# Altium schematic sheet StepperDriver.SchDoc
size A
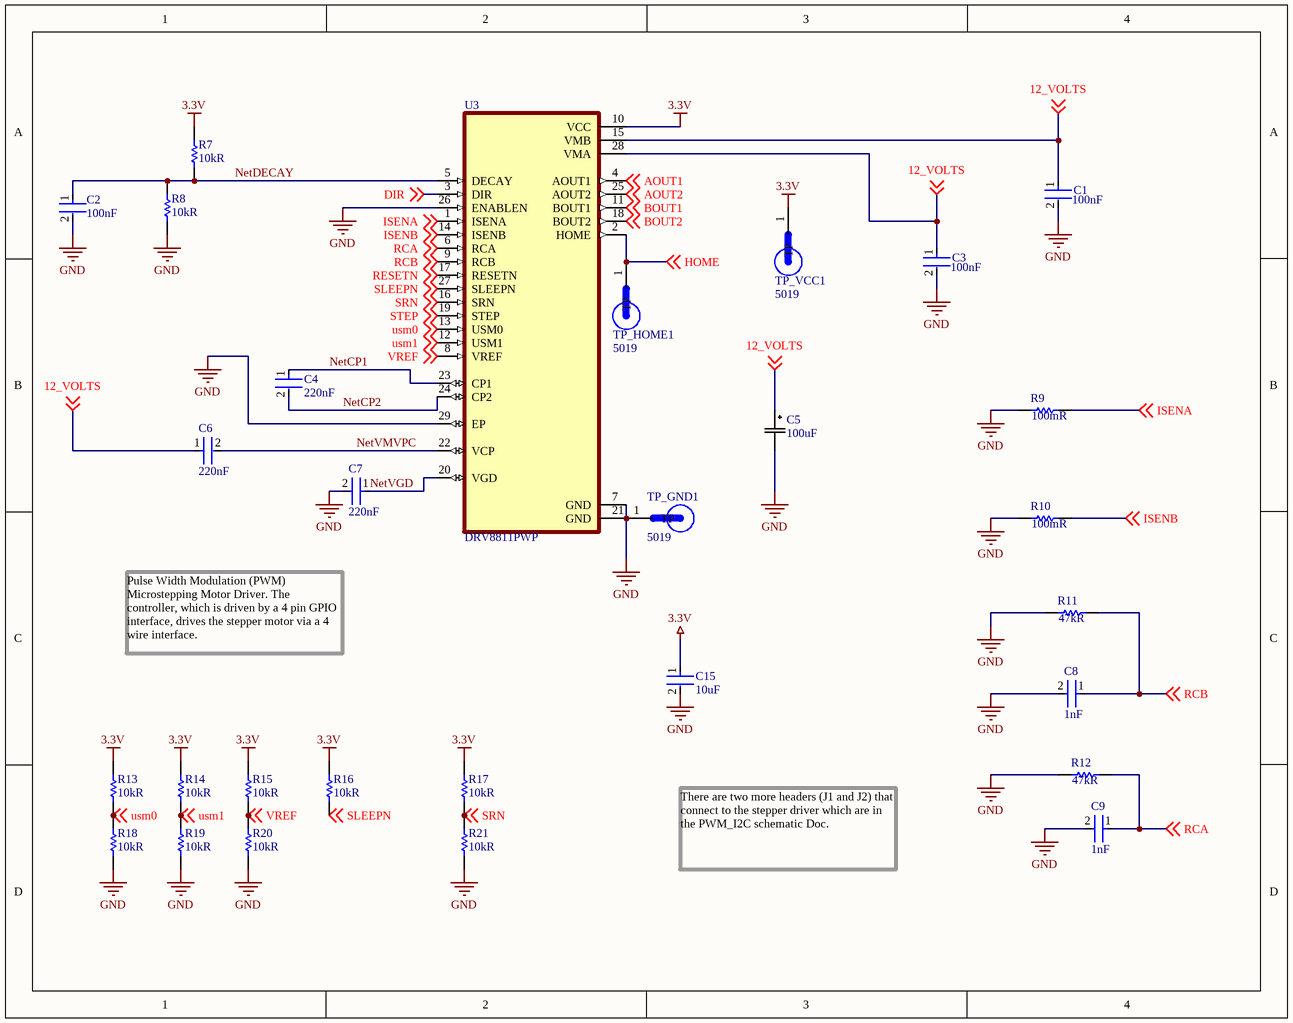
[diagram p0: StepperDriver.SchDoc]

## Parts
C1  Capacitance: 100nF  [FP-CL21-IPC_C]  (hidden comment: CL21B104KACNNNC)
C2  Capacitance: 100nF  [FP-CL21-IPC_C]  (hidden comment: CL21B104KACNNNC)
C3  Capacitance: 100nF  [FP-CL21-IPC_C]  (hidden comment: CL21B104KACNNNC)
C4  Capacitance: 220nF  [FP-0805-L_2_0_0_1-W_1_25-IPC_A]  (hidden comment: UMK212B7224KG-T)
C5  Capacitance: 100uF  [CAP_PC_8X7_NCH]  (hidden comment: PCV1D101MCL2GS)
C6  Capacitance: 220nF  [FP-0805-L_2_0_0_1-W_1_25-IPC_A]  (hidden comment: UMK212B7224KG-T)
C7  Capacitance: 220nF  [FP-0805-L_2_0_0_1-W_1_25-IPC_A]  (hidden comment: UMK212B7224KG-T)
C8  Capacitance: 1nF  [FP-0805-L_2_01_0_2-W_1_25-IPC_C]  (hidden comment: 08055C102KAT2A)
C9  Capacitance: 1nF  [FP-0805-L_2_01_0_2-W_1_25-IPC_C]  (hidden comment: 08055C102KAT2A)
C15  value 10uF  [FP-C0805C-DG-MFG]  (hidden comment: C0805C106K8PACTU)
R7  Resistance: 10kR  [RESC2013X60X35NL10T20]  (hidden comment: RC0805FR-0710KL)
R8  Resistance: 10kR  [RESC2013X60X35NL10T20]  (hidden comment: RC0805FR-0710KL)
R9  Resistance: 100mR  [RESC2013X65X35ML10T20]  (hidden comment: PT0805FR-7W0R1L)
R10  Resistance: 100mR  [RESC2013X65X35ML10T20]  (hidden comment: PT0805FR-7W0R1L)
R11  Resistance: 47kR  [RESC2013X70X40ML20T20]  (hidden comment: ERJ-6GEYJ473V)
R12  Resistance: 47kR  [RESC2013X70X40ML20T20]  (hidden comment: ERJ-6GEYJ473V)
R13  Resistance: 10kR  [RESC2013X60X35NL10T20]  (hidden comment: RC0805FR-0710KL)
R14  Resistance: 10kR  [RESC2013X60X35NL10T20]  (hidden comment: RC0805FR-0710KL)
R15  Resistance: 10kR  [RESC2013X60X35NL10T20]  (hidden comment: RC0805FR-0710KL)
R16  Resistance: 10kR  [RESC2013X60X35NL10T20]  (hidden comment: RC0805FR-0710KL)
R17  Resistance: 10kR  [RESC2013X60X35NL10T20]  (hidden comment: RC0805FR-0710KL)
R18  Resistance: 10kR  [RESC2013X60X35NL10T20]  (hidden comment: RC0805FR-0710KL)
R19  Resistance: 10kR  [RESC2013X60X35NL10T20]  (hidden comment: RC0805FR-0710KL)
R20  Resistance: 10kR  [RESC2013X60X35NL10T20]  (hidden comment: RC0805FR-0710KL)
R21  Resistance: 10kR  [RESC2013X60X35NL10T20]  (hidden comment: RC0805FR-0710KL)
TP_GND1  5019  [TP380X203]
TP_HOME1  5019  [TP380X203]
TP_VCC1  5019  [TP380X203]
U3  DRV8811PWP  [IC_TPS61196PWPRQ1]

## Nets
3.3V: C15.1 R7.2 R13.2 R14.2 R15.2 R16.2 R17.2 TP_VCC1.1(TP) U3.10(VCC)
GND: C1.2 C2.2 C3.2 C5.2 C7.2 C8.2 C9.2 C15.2 R8.1 R9.1 R10.1 R11.1 R12.1 R18.1 R19.1 R20.1 R21.1 TP_GND1.1(TP) U3.7(GND) U3.21(GND) U3.26(ENABLEN) U3.29(EP)
12_VOLTS: C1.1 C3.1 C5.1 C6.1 U3.15(VMB) U3.28(VMA) ; off-sheet 12_VOLTS
AOUT1: U3.4(AOUT1) ; off-sheet AOUT1
AOUT2: U3.25(AOUT2) ; off-sheet AOUT2
BOUT1: U3.11(BOUT1) ; off-sheet BOUT1
BOUT2: U3.18(BOUT2) ; off-sheet BOUT2
DIR: U3.3(DIR) ; off-sheet DIR
HOME: TP_HOME1.1(TP) U3.2(HOME) ; off-sheet HOME
ISENA: R9.2 U3.1(ISENA) ; off-sheet ISENA
ISENB: R10.2 U3.14(ISENB) ; off-sheet ISENB
NetCP1: C4.1 U3.23(CP1)
NetCP2: C4.2 U3.24(CP2)
NetDECAY: C2.1 R7.1 R8.2 U3.5(DECAY)
NetVGD: C7.1 U3.20(VGD)
NetVMVPC: C6.2 U3.22(VCP)
RCA: C9.1 R12.2 U3.6(RCA) ; off-sheet RCA
RCB: C8.1 R11.2 U3.9(RCB) ; off-sheet RCB
RESETN: U3.17(RESETN) ; off-sheet RESETN
SLEEPN: R16.1 U3.27(SLEEPN) ; off-sheet SLEEPN
SRN: R17.1 R21.2 U3.16(SRN) ; off-sheet SRN
STEP: U3.19(STEP) ; off-sheet STEP
usm0: R13.1 R18.2 U3.13(USM0) ; off-sheet usm0
usm1: R14.1 R19.2 U3.12(USM1) ; off-sheet usm1
VREF: R15.1 R20.2 U3.8(VREF) ; off-sheet VREF

## Notes on the sheet
- Pulse Width Modulation (PWM) Microstepping Motor Driver. The controller, which is driven by a 4 pin GPIO interface, drives the stepper motor via a 4 wire interface.
- There are two more headers (J1 and J2) that connect to the stepper driver which are in the PWM_I2C schematic Doc.

## Library data of the parts
C1-C3 = CMP-13271-002854-1: CL21 Series 0805 100nF 25V ±10% Tolerance X7R Multilayer Ceramic Chip Capacitor; Manufacturer: Samsung; Thickness: 0.037inch; Dielectric: X7R; Packaging: Tape and Reel; Height: 0.85mm; Case/Package: 0805; Mount: Surface Mount; Case Code (Imperial): 0805; Case Code (Metric): 2012; Length: 2mm; Voltage Rating: 25V; Voltage: 25V; Contact Plating: Tin; Tolerance: 10%; Max Operating Temperature: 125°C; Width: 0.049inch; Min Operating Temperature: -55°C; Radiation Hardening: No; Package Quantity: 1; Depth: 1.25mm; Supplier 1: Digi-Key; Supplier Part Number 1: 1276-1099-1-ND; Manufacturer Part Number: CL21B104KACNNNC; RoHS: Yes; Category: Ceramic Capacitors; Stock 1: 1473590; Pricing 1: 1=0.10000, 10=0.03700, 50=0.02020, 100=0.01650, 500=0.01178, 1000=0.00925 (USD); Series: CL; Construction: Flat; RoHS Compliant: Yes; ComponentLink1URL: https://datasheet.ciiva.com/25801/cl21b104kacnnnc-25801824.pdf?src-supplier=Digi-Key; ComponentLink1Description: https://datasheet.ciiva.com/25801/cl21b104kacnnnc-25801824.pdf?src-supplier=Digi-Key; ComponentLink2URL: https://datasheet.ciiva.com/15216/getdatasheetpartid-355204-15216236.pdf?src-supplier=Verical; ComponentLink2Description: https://datasheet.ciiva.com/15216/getdatasheetpartid-355204-15216236.pdf?src-supplier=Verical
C4 C6 C7 = CMP-14477-005057-2: Multilayer Ceramic Capacitor 0.22 uF 50V X7R 10% SMD 0805 T/R; Manufacturer: Taiyo Yuden; Voltage Rating: 50V; Width: 0.049inch; Series: M; Tolerance: 10%; Dielectric: X7R; Min Operating Temperature: -55°C; Mount: Surface Mount; Length: 2mm; RoHS Compliant: Yes; Radiation Hardening: No; Contact Plating: Nickel; Depth: 1.25mm; Case Code (Imperial): 0805; Height: 1.25mm; Construction: Flat; Case/Package: 0805; Thickness: 0.053inch; Voltage: 50V; Case Code (Metric): 2012; Halogen Free: Halogen Free; Termination: SMD/SMT; Package Quantity: 1; Max Operating Temperature: 125°C; Packaging: Tape and Reel; Voltage Rating (DC): 50V; Supplier 1: Digi-Key; Supplier Part Number 1: 587-1287-1-ND; Manufacturer Part Number: UMK212B7224KG-T; RoHS: Yes; Category: Ceramic Capacitors; Stock 1: 1309484; Pricing 1: 1=0.13000, 10=0.09300, 50=0.05300, 100=0.04390, 500=0.03080, 1000=0.02550 (USD); REACH SVHC: Unknown; ComponentLink1URL: https://datasheet.ciiva.com/133/umk212b7224kg-t-ss-133747.pdf?src-supplier=Digi-Key; ComponentLink1Description: https://datasheet.ciiva.com/133/umk212b7224kg-t-ss-133747.pdf?src-supplier=Digi-Key; ComponentLink2URL: https://datasheet.ciiva.com/30106/209umk212b7224kg-t-30106923.pdf?src-supplier=Onlinecomponents.com; ComponentLink2Description: https://datasheet.ciiva.com/30106/209umk212b7224kg-t-30106923.pdf?src-supplier=Onlinecomponents.com; ComponentLink3URL: https://datasheet.ciiva.com/15922/1134umk212b7224kg-t-15922643.pdf?src-supplier=Onlinecomponents.com; ComponentLink3Description: https://datasheet.ciiva.com/15922/1134umk212b7224kg-t-15922643.pdf?src-supplier=Onlinecomponents.com; ComponentLink4URL: https://datasheet.ciiva.com/15165/getdatasheetpartid-63436-15165368.pdf?src-supplier=Verical; ComponentLink4Description: https://datasheet.ciiva.com/15165/getdatasheetpartid-63436-15165368.pdf?src-supplier=Verical; ComponentLink5URL: https://datasheet.ciiva.com/30164/55umk212b7224kg-t-30164219.pdf?src-supplier=Onlinecomponents.com; ComponentLink5Description: https://datasheet.ciiva.com/30164/55umk212b7224kg-t-30164219.pdf?src-supplier=Onlinecomponents.com; ComponentLink6URL: https://datasheet.ciiva.com/28645/746258-28645309.pdf?src-supplier=Element14; ComponentLink6Description: https://datasheet.ciiva.com/28645/746258-28645309.pdf?src-supplier=Element14
C5 = PCV1D101MCL2GS: Cap Aluminum Polymer 100uF 20VDC 20% (8 X 7mm) SMD 0.042 Ohm 1400mA 3000h 105C Automotive T/R; Mfr_Name: Nichicon; Type: DEV; Voltage Rating (DC): 20V; ESR (Equivalent Series Resistance): 42mR; Ripple Current: 1.4A; Leakage Current: 400uA; Polarity: Polar; Dissipation Factor: 0.12%; Life (Hours): 3000Hour; Copyright: Copyright (C) 2022 Ultra Librarian. All rights reserved.; Manufacturer_Part_Number: PCV1D101MCL2GS; Digi-Key_Part_Number_1: 493-4532-1-ND; Digi-Key_Part_Number_2: 493-4532-2-ND; Digi-Key_Part_Number_3: 493-4532-6-ND; RefDes: RefDes; Supplier 1: Digi-Key; Supplier Part Number 1: 493-4532-1-ND; Manufacturer: Nichicon; Manufacturer Part Number: PCV1D101MCL2GS; RoHS: Yes; Category: Polymer Capacitors; Stock 1: 12604; Pricing 1: 1=2.46000, 10=1.99300, 50=1.73900, 100=1.52170, 500=1.15938 (USD); Mount: Surface Mount,PCB; Case/Package: Radial; Min Operating Temperature: -55°C; Max Operating Temperature: 105°C; Tolerance: 20%; Package Quantity: 1; Voltage Rating: 20V; Packaging: Tape and Reel; Termination: SMD/SMT; Voltage: 20V; Series: CV; Diameter: 8mm; Length: 7mm; Height: 7mm; Height - Seated (Max): 0.276inch; Lead Pitch: 3.2mm; RoHS Compliant: Yes; ComponentLink1URL: https://datasheet.ciiva.com/115/e-cv-115994.pdf?src-supplier=Digi-Key; ComponentLink1Description: https://datasheet.ciiva.com/115/e-cv-115994.pdf?src-supplier=Digi-Key; ComponentLink2URL: https://datasheet.ciiva.com/115/e-cv-115995.pdf?src-supplier=Digi-Key; ComponentLink2Description: https://datasheet.ciiva.com/115/e-cv-115995.pdf?src-supplier=Digi-Key; ComponentLink3URL: https://datasheet.ciiva.com/115/e-cv-115996.pdf?src-supplier=Digi-Key; ComponentLink3Description: https://datasheet.ciiva.com/115/e-cv-115996.pdf?src-supplier=Digi-Key
C8 C9 = CMP-1036-02979-3: General Purpose Ceramic Capacitor, 0805, 1nF, 10%, X7R, 0.15, 50V; Manufacturer: Kyocera AVX; Dissipation Factor: 2.5%; Insulation Resistance: 100GR; Radiation Hardening: No; Case Code (Imperial): 0805; Packaging: Tape and Reel; Height: 0.94mm; Number of Pins: 2; REACH SVHC: No SVHC; Case Code (Metric): 2012; Voltage: 50V; Max Operating Temperature: 125°C; Tolerance: 10%; Voltage Rating: 50V; Depth: 1.25mm; Voltage Rating (DC): 50V; Thickness: 0.037inch; Termination: SMD/SMT; Package Quantity: 1; RoHS Compliant: Yes; Mount: Surface Mount; Dielectric: X7R; Length: 2.01mm; Contact Plating: Tin; Lead Free: Lead Free; Case/Package: 0805; Width: 1.25mm; Dielectric Material: Ceramic; Min Operating Temperature: -55°C; Supplier 1: Digi-Key; Supplier Part Number 1: 478-1371-1-ND; Manufacturer Part Number: 08055C102KAT2A; RoHS: Yes; Category: Ceramic Capacitors; Stock 1: 651619; Pricing 1: 1=0.10000, 10=0.07300, 50=0.04000, 100=0.03270, 500=0.02334, 1000=0.01833 (USD); ComponentLink1URL: https://datasheet.ciiva.com/19476/2009543-19476290.pdf?src-supplier=Jameco; ComponentLink1Description: https://datasheet.ciiva.com/19476/2009543-19476290.pdf?src-supplier=Jameco; ComponentLink2URL: https://datasheet.ciiva.com/11786/0900766b802d4698-11786944.pdf?src-supplier=RSComponents; ComponentLink2Description: https://datasheet.ciiva.com/11786/0900766b802d4698-11786944.pdf?src-supplier=RSComponents; ComponentLink3URL: https://datasheet.ciiva.com/150/cx7r-150264.pdf?src-supplier=Digi-Key; ComponentLink3Description: https://datasheet.ciiva.com/150/cx7r-150264.pdf?src-supplier=Digi-Key; ComponentLink4URL: https://datasheet.ciiva.com/150/cx7r-150265.pdf?src-supplier=Digi-Key; ComponentLink4Description: https://datasheet.ciiva.com/150/cx7r-150265.pdf?src-supplier=Digi-Key
C15 = CMP-2007-03243-2: CAP CER 10UF 10V X5R 0805; Manufacturer: Kemet; 3DS Part Number: 220-00001; Tolerance: 10%; Temperature Coefficient: 15%; Material: Ceramic; Device Class L2: Capacitors; Device Class L1: Passive Components; ComponentLink2URL: https://content.kemet.com/datasheets/KEM_C1006_X5R_SMD.pdf; Height: 1.4mm; Lead Free: Yes; Manufacturer Part Number: C0805C106K8PACTU; Digikey Description: CAP CER 10UF 10V X5R 0805; Octopart: https://octopart.com/c0805c106k8pactu-kemet-98697; Capacitance: 10uF; Temperature Range Low: -55°C; Temperature: -55°C to +85°C; Automotive: No; Mouser Description: CAP CER 10UF 10V X5R 0805; Ipc Land Pattern Name: CAPC200125X125; Temperature Range High: +85°C; Voltage: 10V; RoHS: TRUE; Device Class L3: Ceramic Capacitors; ComponentLink2Description: Datasheet; Voltage Rating: 10V; Package: C0805C-DG; Temperature Characteristic: X5R; Category: Cap; Supplier 1: Digi-Key; Supplier Part Number 1: 399-C0805C106K8PAC7800CT-ND; Manufacturer 1: KEMET; Manufacturer Part Number 1: C0805C106K8PACTU; Stock 1: 8631846; Pricing 1: 1=0.14000, 10=0.10300, 50=0.05840, 100=0.04830, 500=0.03388, 1000=0.02805 (USD); Mount: Surface Mount; Case/Package: 0805; Number of Pins: 2; Case Code (Imperial): 0805; Case Code (Metric): 2012; Dielectric Material: Ceramic; Contact Plating: Tin,Matte; Min Operating Temperature: -55°C; Max Operating Temperature: 85°C; Packaging: Tape and Reel; Dielectric: X5R; Package Quantity: 1; Voltage Rating (DC): 10V; Series: C; Termination: SMD/SMT; Construction: Flat; Dissipation Factor: 10%; Length: 2mm; Width: 1.2mm; Depth: 1.25mm; Thickness: 0.055inch; Radiation Hardening: No; REACH SVHC: No SVHC; RoHS Compliant: Yes
R7 R8 R13-R21 = CMP-1659-00013-4: Chip Resistor, 10 KOhm, +/- 1%, 0.125 W, -55 to 155 degC, 0805 (2012 Metric), RoHS, Tape and Reel; Manufacturer: Yageo; Voltage Rating: 150 V; Power Rating: 125mW; Temperature Coefficient: 100ppm/°C; Mount: Surface Mount; ComponentLink1Description: Manufacturer URL; ComponentLink2URL: http://www.yageo.com/documents/recent/PYu-RC_Group_51_RoHS_L_04.pdf; Pins: 2; Length: 2 mm; Min Operating Temperature: -55 degC; Height: 0.5 mm; Mounting Technology: Surface Mount; RoHSCompliant: true; REACH SVHC: No SVHC; ComponentLink1URL: http://www.yageo.com/; Max Operating Temperature: 155 degC; PackageReference: 0805; DatasheetVersion: Rev. 4, 02/2016; Package Quantity: 5000; Packaging: Tape and Reel; ComponentLink2Description: Datasheet; PackageDescription: 2-Pin Surface Mounted Device, Body 2 x 1.25 mm; Supplier 1: Digi-Key; Supplier Part Number 1: 311-10.0KCRCT-ND; Manufacturer Part Number: RC0805FR-0710KL; RoHS: Yes; Category: Chip SMD Resistors; Stock 1: 5888109; Pricing 1: 1=0.10000, 10=0.03800, 100=0.01560, 1000=0.00702, 2500=0.00610 (USD); Case/Package: 0805; Case Code (Imperial): 0805; Case Code (Metric): 2012; Size Code: 0805; Tolerance: 1%; Termination: SMD/SMT; Series: RC; Resistance Tolerance: 1%; Max Power Dissipation: 125mW; Resistor Type: Thick Film; Number of Terminations: 2; Features: Moisture Resistant; Construction: Rectangular; Technology: THICK FILM; Width: 0.049inch; Depth: 1.25mm; RoHS Compliant: Yes; Lead Free: Lead Free; Military Standard: Not; ComponentLink3URL: https://datasheet.ciiva.com/11808/0900766b8106beab-11808151.pdf?src-supplier=RSComponents; ComponentLink3Description: https://datasheet.ciiva.com/11808/0900766b8106beab-11808151.pdf?src-supplier=RSComponents; ComponentLink4URL: https://datasheet.ciiva.com/46447/444164-46447563.pdf?src-supplier=Element14; ComponentLink4Description: https://datasheet.ciiva.com/46447/444164-46447563.pdf?src-supplier=Element14; ComponentLink5URL: https://datasheet.ciiva.com/2456/pyu-r-int-thick-7-2456973.pdf?src-supplier=Digi-Key; ComponentLink5Description: https://datasheet.ciiva.com/2456/pyu-r-int-thick-7-2456973.pdf?src-supplier=Digi-Key; ComponentLink6URL: https://datasheet.ciiva.com/2456/pyu-r-int-thick-7-2456974.pdf?src-supplier=Digi-Key; ComponentLink6Description: https://datasheet.ciiva.com/2456/pyu-r-int-thick-7-2456974.pdf?src-supplier=Digi-Key; ComponentLink7URL: https://datasheet.ciiva.com/2456/pyu-r-int-thick-7-2456972.pdf?src-supplier=Digi-Key; ComponentLink7Description: https://datasheet.ciiva.com/2456/pyu-r-int-thick-7-2456972.pdf?src-supplier=Digi-Key; ComponentLink8URL: https://datasheet.ciiva.com/12669/rc0805-12669688.pdf?src-supplier=Mouser; ComponentLink8Description: https://datasheet.ciiva.com/12669/rc0805-12669688.pdf?src-supplier=Mouser; ComponentLink9URL: https://datasheet.ciiva.com/16747/rc0805-16747087.pdf?src-supplier=Future+Electronics; ComponentLink9Description: https://datasheet.ciiva.com/16747/rc0805-16747087.pdf?src-supplier=Future+Electronics
R9 R10 = CMP-2001-04471-1: Manufacturer: Yageo; Tolerance: 1%; Max Power Dissipation: 250mW; Temperature Coefficient: 100ppm/°C; Part Number: PT0805FR-7W0R1L; Supplier 1: Newark; Supplier Part Number 1: 82AH7709; Manufacturer Part Number: PT0805FR-7W0R1L; RoHS: Yes; Category: Chip SMD Resistors; Stock 1: 80; Pricing 1: 1=0.10900, 10=0.10100, 25=0.09500, 50=0.08900, 100=0.08400 (USD); Case/Package: 0805; Case Code (Imperial): 0805; Case Code (Metric): 2012; Min Operating Temperature: -55°C; Max Operating Temperature: 155°C; Features: Moisture Resistant,Automotive AEC-Q200; Series: PT; Packaging: Tape and Reel; Number of Terminations: 2; Lead Free: Lead Free; RoHS Compliant: Yes; ComponentLink1URL: http://www.mouser.com/ds/2/447/yageodocoutput-1101729.pdf?src-supplier=Mouser; ComponentLink1Description: http://www.mouser.com/ds/2/447/yageodocoutput-1101729.pdf?src-supplier=Mouser; ComponentLink2URL: http://www.yageo.com/exep/pages/download/literatures/R-chip_current%20sensor_20140512.pdf?src-supplier=Digi-Key; ComponentLink2Description: http://www.yageo.com/exep/pages/download/literatures/R-chip_current%20sensor_20140512.pdf?src-supplier=Digi-Key
R11 R12 = CMP-2001-00421-1: Manufacturer: Panasonic; Tolerance: 5%; Temperature Coefficient: 200ppm/°C; Power Rating: 125mW; Voltage Rating: 150V; Part Number: ERJ-6GEYJ473V; Supplier 1: Digi-Key; Supplier Part Number 1: P47KACT-ND; Manufacturer Part Number: ERJ-6GEYJ473V; RoHS: Yes; Category: Chip SMD Resistors; Stock 1: 137402; Pricing 1: 1=0.10000, 10=0.06700, 100=0.02740, 1000=0.01230, 2500=0.01067 (USD); Mount: Surface Mount; Case/Package: 0805; Contact Plating: Tin; Case Code (Metric): 2012; Case Code (Imperial): 0805; Min Operating Temperature: -55°C; Max Operating Temperature: 155°C; Resistor Type: Thick Film; Packaging: Tape and Reel; Package Quantity: 1; Number of Terminations: 2; Termination: SMD/SMT; Max Power Dissipation: 125mW; Voltage Rating (DC): 150V; Series: ERJ; Construction: Rectangular; Technology: THICK FILM; Resistance Tolerance: 5%; Working Voltage: 150V; Features: Automotive AEC-Q200; Length: 2mm; Width: 0.049inch; Height: 0.6mm; Depth: 1.25mm; Radiation Hardening: No; REACH SVHC: No SVHC; Military Standard: Not; Lead Free: Lead Free; RoHS Compliant: Yes; ComponentLink1URL: https://datasheet.ciiva.com/11821/0900766b80f806dd-11821658.pdf?src-supplier=RSComponents; ComponentLink1Description: https://datasheet.ciiva.com/11821/0900766b80f806dd-11821658.pdf?src-supplier=RSComponents; ComponentLink2URL: https://datasheet.ciiva.com/43460/1500035-43460133.pdf?src-supplier=Farnell; ComponentLink2Description: https://datasheet.ciiva.com/43460/1500035-43460133.pdf?src-supplier=Farnell; ComponentLink3URL: https://datasheet.ciiva.com/46389/1500035-46389598.pdf?src-supplier=Element14; ComponentLink3Description: https://datasheet.ciiva.com/46389/1500035-46389598.pdf?src-supplier=Element14; ComponentLink4URL: https://datasheet.ciiva.com/6138/1500035-6138254.pdf?src-supplier=Farnell; ComponentLink4Description: https://datasheet.ciiva.com/6138/1500035-6138254.pdf?src-supplier=Farnell; ComponentLink5URL: https://datasheet.ciiva.com/46377/1500035-46377628.pdf?src-supplier=Element14; ComponentLink5Description: https://datasheet.ciiva.com/46377/1500035-46377628.pdf?src-supplier=Element14; ComponentLink6URL: https://datasheet.ciiva.com/28587/1678796-28587262.pdf?src-supplier=Element14; ComponentLink6Description: https://datasheet.ciiva.com/28587/1678796-28587262.pdf?src-supplier=Element14; ComponentLink7URL: https://datasheet.ciiva.com/24069/aoa0000ce1-37422-24069158.pdf?src-supplier=Mouser; ComponentLink7Description: https://datasheet.ciiva.com/24069/aoa0000ce1-37422-24069158.pdf?src-supplier=Mouser; ComponentLink8URL: https://datasheet.ciiva.com/9189/aoa0000ce1-9189350.pdf?src-supplier=Avnet; ComponentLink8Description: https://datasheet.ciiva.com/9189/aoa0000ce1-9189350.pdf?src-supplier=Avnet; ComponentLink9URL: https://datasheet.ciiva.com/16200/aoa0000ce1-16200503.pdf?src-supplier=Future+Electronics; ComponentLink9Description: https://datasheet.ciiva.com/16200/aoa0000ce1-16200503.pdf?src-supplier=Future+Electronics; ComponentLink10URL: https://datasheet.ciiva.com/48531/aoa0000ce1-48531646.pdf?src-supplier=Avnet; ComponentLink10Description: https://datasheet.ciiva.com/48531/aoa0000ce1-48531646.pdf?src-supplier=Avnet; ComponentLink11URL: https://datasheet.ciiva.com/30260/4aoa0000ce1-30260694.pdf?src-supplier=Onlinecomponents.com; ComponentLink11Description: https://datasheet.ciiva.com/30260/4aoa0000ce1-30260694.pdf?src-supplier=Onlinecomponents.com
TP_GND1 TP_HOME1 TP_VCC1 = 5019: PC Test Point, Miniature Phosphor Bronze, Silver Plating Surface Mount Mounting Type; MF: Keystone Electronics; Value: *; MP: 5019; Package: 2010 Keystone; SnapEDA_Link: https://www.snapeda.com/parts/5019/Keystone%20Electronics/view-part/449144/?ref=snap; Digi-Key_Part_Number: 36-5019CT-ND; Digi-Key_Purchase_URL: https://www.digikey.com/product-detail/en/keystone-electronics/5019/36-5019CT-ND/3907344?utm_source=snapeda&utm_medium=aggregator&utm_campaign=symbol
U3 = DRV8811PWP: 38-V, 1.9-A bipolar stepper motor driver with current regulation and 1/8 microstepping 28-HTSSOP -40 to 85; MF: Texas Instruments; SnapEDA_Link: https://www.snapeda.com/parts/DRV8811PWP/Texas%20Instruments/view-part/471965/?ref=snap; Availability: Good; Check_prices: https://www.snapeda.com/parts/DRV8811PWP/Texas%20Instruments/view-part/471965/?ref=eda; MP: DRV8811PWP; Price: None; Purchase-URL: https://pricing.snapeda.com/search/part/DRV8811PWP/?ref=eda; Package: HTSSOP-28 Texas Instruments; Value: *